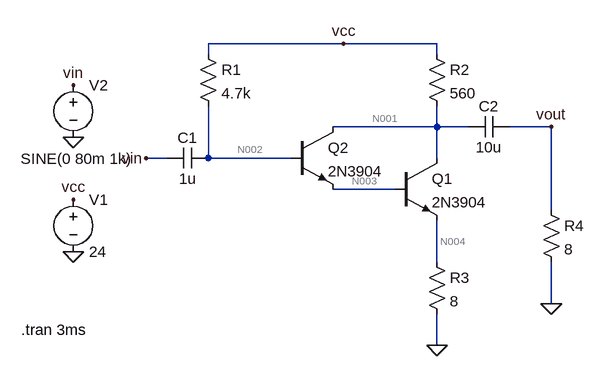
[diagram p0: schematic darlington_pair.asc]
darlington_pair.asc, the LTspice schematic file:
Version 4.1
SHEET 1 880 680
WIRE -64 -32 -272 -32
WIRE 80 -32 -64 -32
WIRE -272 -16 -272 -32
WIRE 80 -16 80 -32
WIRE 80 96 80 64
WIRE 80 96 -80 96
WIRE 128 96 80 96
WIRE 256 96 192 96
WIRE -336 144 -368 144
WIRE -272 144 -272 64
WIRE -144 144 -272 144
WIRE 80 144 80 96
WIRE 16 192 -80 192
WIRE 256 224 256 96
WIRE 80 304 80 240
WIRE 256 368 256 304
WIRE 80 432 80 384
FLAG -480 208 vcc
FLAG -480 288 0
FLAG -480 112 0
FLAG -480 32 vin
FLAG 80 432 0
FLAG -368 144 vin
FLAG 256 368 0
FLAG -64 -32 vcc
FLAG 256 96 vout
SYMBOL voltage -480 192 R0
WINDOW 123 0 0 Left 0
WINDOW 39 0 0 Left 0
SYMATTR InstName V1
SYMATTR Value 24
SYMBOL voltage -480 16 R0
WINDOW 3 -81 129 Left 2
WINDOW 123 0 0 Left 0
WINDOW 39 0 0 Left 0
SYMATTR InstName V2
SYMATTR Value SINE(0 80m 1k)
SYMBOL npn 16 144 R0
SYMATTR InstName Q1
SYMATTR Value 2N3904
SYMBOL npn -144 96 R0
SYMATTR InstName Q2
SYMATTR Value 2N3904
SYMBOL res -288 -32 R0
SYMATTR InstName R1
SYMATTR Value 4.7k
SYMBOL res 64 288 R0
SYMATTR InstName R3
SYMATTR Value 8
SYMBOL cap -336 128 M90
WINDOW 0 0 32 VBottom 2
WINDOW 3 32 32 VTop 2
SYMATTR InstName C1
SYMATTR Value 1u
SYMBOL cap 192 80 R90
WINDOW 0 0 32 VBottom 2
WINDOW 3 32 32 VTop 2
SYMATTR InstName C2
SYMATTR Value 10u
SYMBOL res 240 208 R0
SYMATTR InstName R4
SYMATTR Value 8
SYMBOL res 64 -32 R0
SYMATTR InstName R2
SYMATTR Value 560
TEXT -560 408 Left 2 !.tran 3ms

The netlist it stands for:
* darlington_pair.asc
V1 vcc 0 24
V2 vin 0 SINE(0 80m 1k)
Q1 N001 N003 N004 0 2N3904
Q2 N001 N002 N003 0 2N3904
R1 vcc N002 4.7k
R3 N004 0 8
C1 vin N002 1u
C2 vout N001 10u
R4 vout 0 8
R2 vcc N001 560
.model NPN NPN
.model PNP PNP
.lib standard.bjt
.tran 3ms
.backanno
.end

* Results of the author's LTspice run, read from the files saved beside the schematic
* Operating Point, zero values left out:
*   V(n003) = 1.129 V
*   V(n004) = 364.3 mV
*   V(vcc) = 24 V
*   V(n001) = 1.128 V
*   V(n002) = 1.953 V
*   I(V1) = -45.53 mA
*   Ic(Q1) = 45.36 mA
*   Ib(Q1) = 168.4 µA
*   Ie(Q1) = -45.53 mA
*   I(R3) = 45.53 mA
*   I(R1) = 4.691 mA
*   Ic(Q2) = -4.522 mA
*   Ib(Q2) = 4.691 mA
*   Ie(Q2) = -168.4 µA
*   I(R2) = 40.84 mA
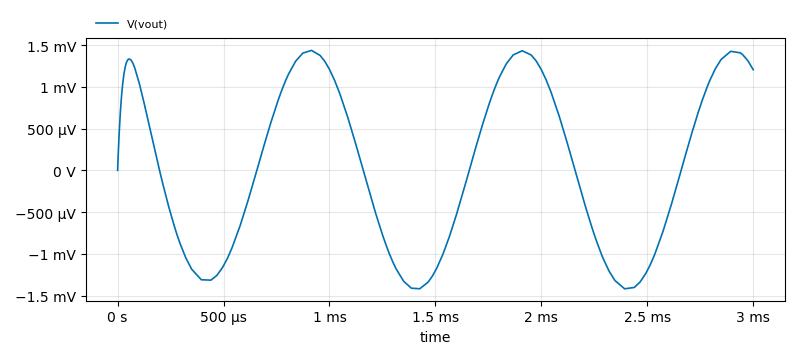
[diagram p1: Transient Analysis of darlington_pair.asc, plotted from the saved traces]
* Transient Analysis, 1 run:
*   V(vout): min -1.419 mV, max 1.438 mV, average 41.11 µV, rms 1.008 mV, last 1.206 mV